# Altium schematic sheet Sensors.schdoc
size 222 x 130 mm
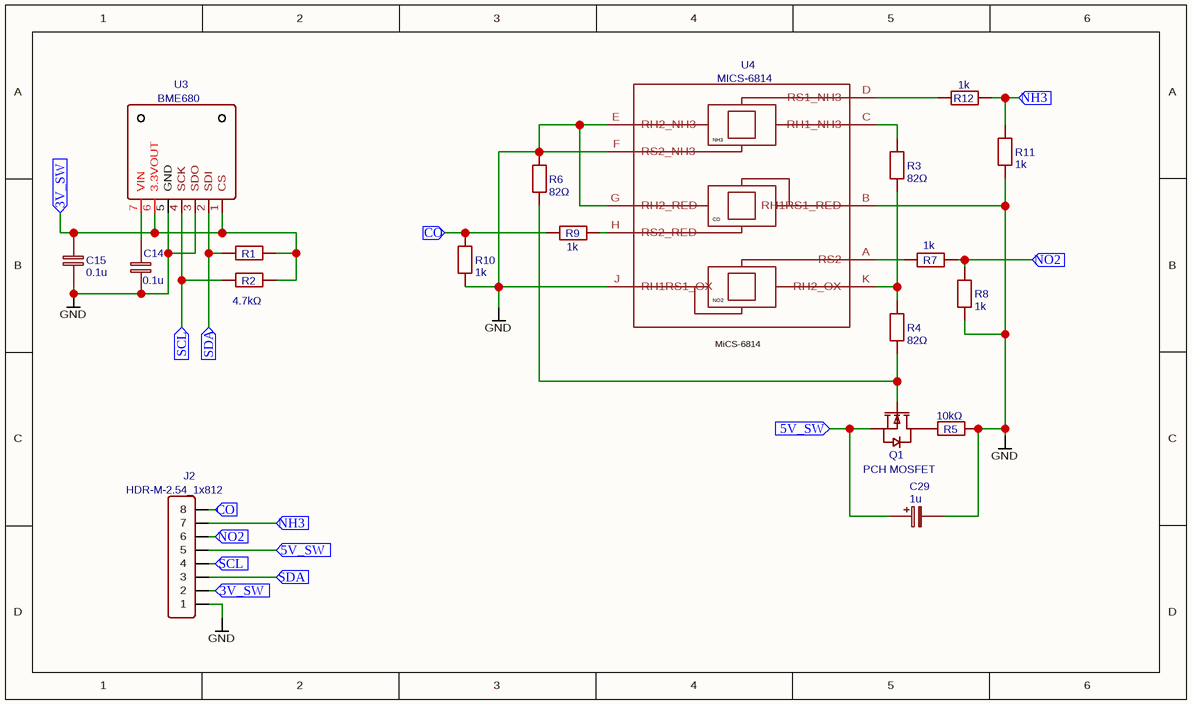
[diagram p0: Sensors.schdoc]

## Parts
C14  0.1u  [C0603]
C15  0.1u  [C0603]
C29  1u  [CASE-A_3216]
J2  HDR-M-2.54_1x812  [HDR-M-2.54_1X8]
Q1  PCH MOSFET  [PG-SOT23-3_L2.9-W1.3-P1.90-LS2.4-BR]
R1  4.7kΩ  [R0603]
R2  4.7kΩ  [R0603]  (value not drawn)
R3  82Ω  [R0603]
R4  82Ω  [R0603]
R5  10kΩ  [R0603]
R6  82Ω  [R0603]
R7  1k  [R0603]
R8  1k  [R0603]
R9  1k  [R0603]
R10  1k  [R0603]
R11  1k  [R0603]
R12  1k  [R0603]
U3  BME680  [LGA-8-3X3MM]
U4  MICS-6814  [SNR10-SMD-1.25-7.5X5.5MM]

## Ports
3V_SW (in), 5V_SW (in), CO (in), NH3 (in), NO2 (in), SCL (in), SDA (in)

## Nets
GND: C14.1 C15.1 C29.2 J2.1 R5.1 R6.1 R8.1 R10.2 R11.2 U3.3(SDO) U3.5(GND) U4.B(RH1RS1_RED) U4.E(RH2_NH3) U4.F(RS2_NH3) U4.G(RH2_RED) U4.J(RH1RS1_OX)
3V_SW: C15.2 J2.2 R1.1 R2.1 U3.1(CS) U3.6(3.3VOUT) ; port 3V_SW
5V_SW: C29.1 J2.5 Q1.2(S) ; port 5V_SW
CO: J2.8 R9.1 R10.1 ; port CO
NH3: J2.7 R11.1 R12.2 ; port NH3
NO2: J2.6 R7.2 R8.2 ; port NO2
SCL: J2.4 R2.2 U3.4(SCK) ; port SCL
SDA: J2.3 R1.2 U3.2(SDI) ; port SDA
NetC14_2: C14.2 U3.7(VIN)
NetQ1_1: Q1.1(G) R4.1 R6.2
NetQ1_3: Q1.3(D) R5.2
NetR3_1: R3.1 R4.2 U4.K(RH2_OX)
NetR3_2: R3.2 U4.C(RH1_NH3)
NetR7_1: R7.1 U4.A(RS2)
NetR9_2: R9.2 U4.H(RS2_RED)
NetR12_1: R12.1 U4.D(RS1_NH3)

## Notes on the sheet
- (in symbol MICS-6814) NH3; CO; NO2; MiCS-6814

## Library data of the parts
C14 C15 = 0.1u: nameAlias: Value(F); Contributor: LCEDA_Lib; spicePre: C; spiceSymbolName: C_0603_EU
C29 = 1u: nameAlias: Value(F); Contributor: LCEDA_Lib; spicePre: C; spiceSymbolName: C_Tan_SMD_A_EU
J2 = HDR-M-2.54_1x812: Contributor: Hane_Jared; BOM_Supplier Part: C190820; BOM_Supplier: LCSC; spicePre: J; spiceSymbolName: HDR-M-2.54_1x812
Q1 = PCH MOSFET: BOM_Manufacturer: VBsemi Elec; BOM_Manufacturer Part: VB1240B; Contributor: LCSC; BOM_Supplier: LCSC; BOM_Supplier Part: C516873; BOM_JLCPCB Part Class: Extended Part; spicePre: Q; spiceSymbolName: VB1240B
R1 R2 = 4.7kΩ: BOM_Manufacturer: UNI-ROYAL(Uniroyal Elec); BOM_Manufacturer Part: TC0350D4701T5H; nameAlias: Resistance; Contributor: LCSC; BOM_Supplier: LCSC; BOM_Supplier Part: C517493; Resistance (Ohms): 4.7kΩ; BOM_JLCPCB Part Class: Extended Part; spicePre: R; spiceSymbolName: TC0350D4701T5H
R3 R4 R6 = 82Ω: BOM_Manufacturer: Resistor.Today; BOM_Manufacturer Part: TCTR0603F47K0F3960T; Contributor: LCSC; BOM_Supplier: LCSC; BOM_Supplier Part: C525388; BOM_JLCPCB Part Class: Extended Part; spicePre: R; spiceSymbolName: TCTR0603F47K0F3960T
R5 = 10kΩ: BOM_Manufacturer: Resistor.Today; BOM_Manufacturer Part: TCTR0603F47K0F3960T; Contributor: LCSC; BOM_Supplier: LCSC; BOM_Supplier Part: C525388; BOM_JLCPCB Part Class: Extended Part; spicePre: R; spiceSymbolName: TCTR0603F47K0F3960T
R7-R12 = 1k: nameAlias: Value(Ω); Contributor: LCEDA_Lib; spicePre: R; spiceSymbolName: R_0603_EU
U3 = BME680: BOM_Manufacturer: Bosch Sensortec; Contributor: mecopela; BOM_Supplier: LCSC; BOM_Supplier Part: C125972; BOM_Manufacturer Part: BME680; spicePre: U; spiceSymbolName: BME680_ADAFRUIT
U4 = MICS-6814: description: 314100015; Contributor: sozturk; spicePre: U; spiceSymbolName: SENSOR-MICS-6814